# EAGLE schematic modulev2 (EAGLE 9.5.1)
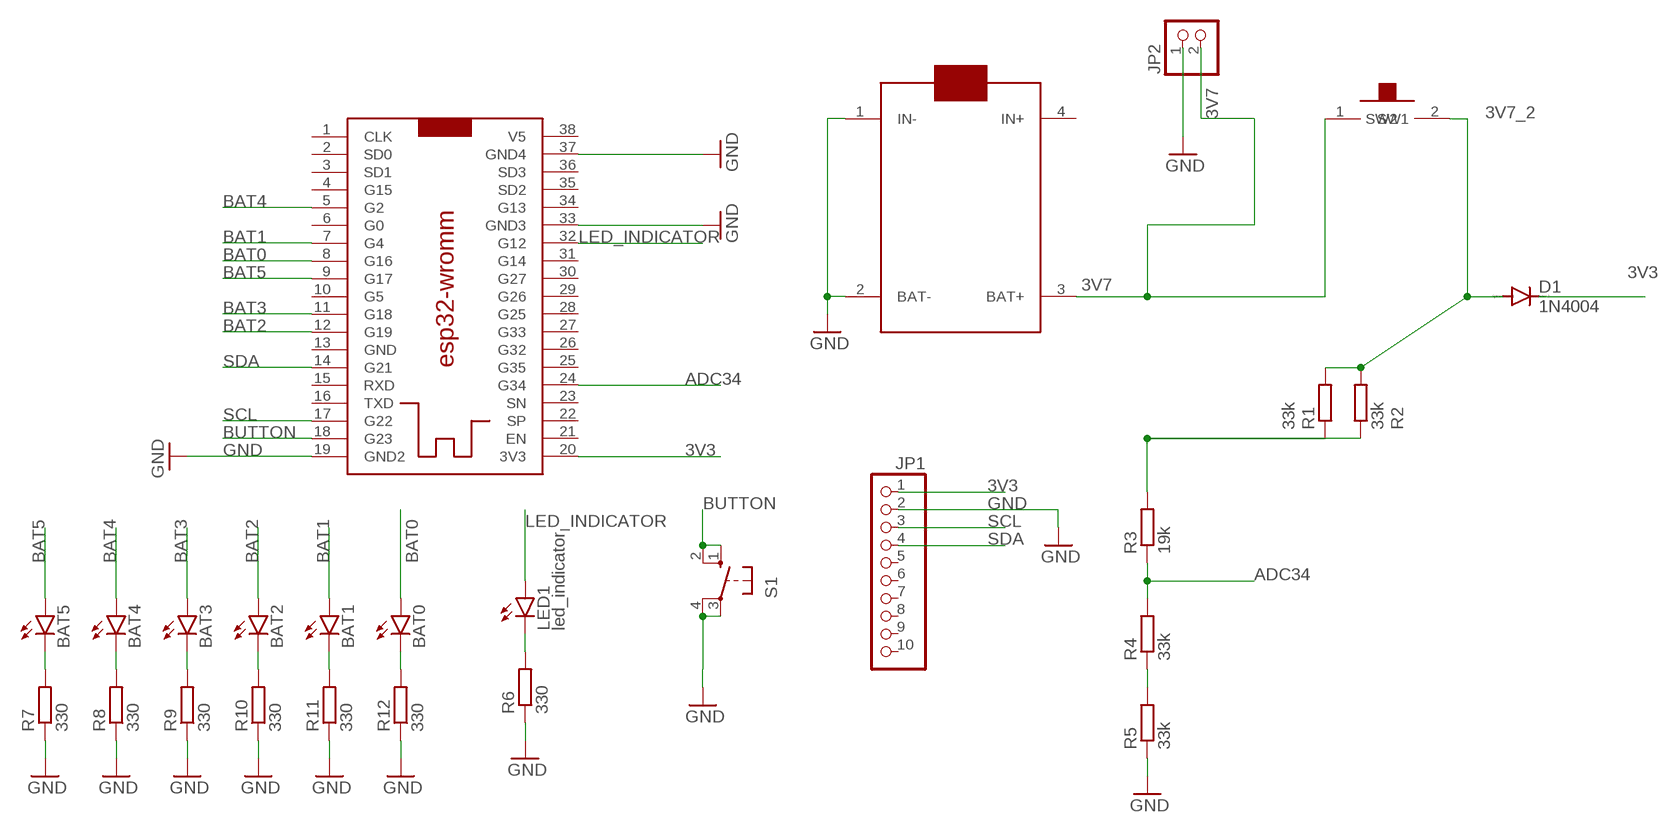
[diagram p0: schematic, sheet 1]

## Parts
BAT0  led_indicator  LED3MM  [LED3MM]
BAT1  led_indicator  LED3MM  [LED3MM]
BAT2  led_indicator  LED3MM  [LED3MM]
BAT3  led_indicator  LED3MM  [LED3MM]
BAT4  led_indicator  LED3MM  [LED3MM]
BAT5  led_indicator  LED3MM  [LED3MM]
D1  1N4004  [DO41-10]
JP1  PINHD-1X10  [1X10]
JP2  PINHD-1X2  [1X02]
LED1  led_indicator  LED3MM  [LED3MM]
R1  33k  R-EU_0204/7  [0204/7]
R2  33k  R-EU_0204/7  [0204/7]
R3  19k  R-EU_0204/7  [0204/7]
R4  33k  R-EU_0204/7  [0204/7]
R5  33k  R-EU_0204/7  [0204/7]
R6  330  R-EU_0204/7  [0204/7]
R7  330  R-EU_0204/7  [0204/7]
R8  330  R-EU_0204/7  [0204/7]
R9  330  R-EU_0204/7  [0204/7]
R10  330  R-EU_0204/7  [0204/7]
R11  330  R-EU_0204/7  [0204/7]
R12  330  R-EU_0204/7  [0204/7]
S1  10-XX  [B3F-10XX]
U$1  ESP32-WROMM2  [ESP32-WORMM2]
U$2  CHARGET_MODULE  [CHARGET_MODULE]
U$3  MINI_SWITCH  [MINI_SWITCH]

## Nets
3V3: D1.C JP1.1 U$1.20(3V3)
3V7: JP2.2 U$2.3(BAT+) U$3.1(SW1)
3V7_2: D1.A R1.2 R2.2 U$3.2(SW2)
ADC34: R3.1 R4.2 U$1.24(G34)
BAT0: BAT0.A U$1.8(G16)
BAT1: BAT1.A U$1.7(G4)
BAT2: BAT2.A U$1.12(G19)
BAT3: BAT3.A U$1.11(G18)
BAT4: BAT4.A U$1.5(G2)
BAT5: BAT5.A U$1.9(G17)
BUTTON: S1.1(S) S1.2(S1) U$1.18(G23)
GND: JP1.2 JP2.1 R5.1 R6.1 R7.1 R8.1 R9.1 R10.1 R11.1 R12.1 S1.3(P) S1.4(P1) U$1.19(GND2) U$1.33(GND3) U$1.37(GND4) U$2.1(IN-) U$2.2(BAT-)
LED_INDICATOR: LED1.A U$1.32(G12)
N$1: R4.1 R5.2
N$2: LED1.K(C) R6.2
N$3: BAT5.K(C) R7.2
N$4: R1.1 R2.1 R3.2
N$5: BAT4.K(C) R8.2
N$7: BAT3.K(C) R9.2
N$8: BAT2.K(C) R10.2
N$9: BAT1.K(C) R11.2
N$10: BAT0.K(C) R12.2
SCL: JP1.3 U$1.17(G22)
SDA: JP1.4 U$1.14(G21)
Unconnected: JP1.5 JP1.6 JP1.7 JP1.8 JP1.9 JP1.10 U$1.1(CLK) U$1.2(SD0) U$1.3(SD1) U$1.4(G15) U$1.6(G0) U$1.10(G5) U$1.13(GND) U$1.15(RXD) U$1.16(TXD) U$1.21(EN) U$1.22(SP) U$1.23(SN) U$1.25(G35) U$1.26(G32) U$1.27(G33) U$1.28(G25) U$1.29(G26) U$1.30(G27) U$1.31(G14) U$1.34(G13) U$1.35(SD2) U$1.36(SD3) U$1.38(V5) U$2.4(IN+)

## Library data of the parts
BAT0 BAT1-BAT5 LED1 = led:LED: LED OSRAM: - CHIPLED LG R971, LG N971, LY N971, LG Q971, LY Q971, LO R971, LY R971 LH N974, LH R974 LS Q976, LO Q976, LY Q976 LO Q996 - Hyper CHIPLED LW Q18S LB Q993, LB Q99A, LB R99A - SideLED LS A670, LO A670, LY A670, LG A670, LP A670 LB A673, LV A673, LT A673, LW A673 LH A674 LY A675 LS A676, LA A676, LO A676, LY A676, LW A676 LS A679, LY A679, LG A679 - Hyper Micro SIDELED® LS Y876, LA Y876, LO Y876, LY Y876 LT Y87S - SmartLED LW L88C, LW L88S LB L89C, LB L89S, LG L890 LS L89K, LO L89K, LY L89K LS L896, LA L896, LO L896, LY L896 - TOPLED LS T670, LO T670, LY T670, LG T670, LP T670 LSG T670, LSP T670, LSY T670, LOP T670, LYG T670 LG T671, LOG T671, LSG T671 LB T673, LV T673, LT T673, LW T673 LH T674 LS T676, LA T676, LO T676, LY T676, LB T676, LH T676, LSB T676, LW T676 LB T67C, LV T67C, LT T67C, LS T67K, LO T67K, LY T67K, LW E67C LS E67B, LA E67B, LO E67B, LY E67B, LB E67C, LV E67C, LT E67C LW T67C LS T679, LY T679, LG T679 LS T770, LO T770, LY T770, LG T770, LP T770 LB T773, LV T773, LT T773, LW T773 LH T774 LS E675, LA E675, LY E675, LS T675 LS T776, LA T776, LO T776, LY T776, LB T776 LHGB T686 LT T68C, LB T68C - Hyper Mini TOPLED® LB M676 - Mini TOPLED Santana® LG M470 LS M47K, LO M47K, LY M47K Source: http://www.osram.convergy.de LUXEON: - LUMILED® LXK2-PW12-R00, LXK2-PW12-S00, LXK2-PW14-U00, LXK2-PW14-V00 LXK2-PM12-R00, LXK2-PM12-S00, LXK2-PM14-U00 LXK2-PE12-Q00, LXK2-PE12-R00, LXK2-PE12-S00, LXK2-PE14-T00, LXK2-PE14-U00 LXK2-PB12-K00, LXK2-PB12-L00, LXK2-PB12-M00, LXK2-PB14-N00, LXK2-PB14-P00, LXK2-PB14-Q00 LXK2-PR12-L00, LXK2-PR12-M00, LXK2-PR14-Q00, LXK2-PR14-R00 LXK2-PD12-Q00, LXK2-PD12-R00, LXK2-PD12-S00 LXK2-PH12-R00, LXK2-PH12-S00 LXK2-PL12-P00, LXK2-PL12-Q00, LXK2-PL12-R00 Source: www.luxeon.com KINGBRIGHT: KA-3528ASYC Source: www.kingbright.com
D1 = diode:1N4004: DIODE general purpose rectifier, 1 A
JP1 = pinhead:PINHD-1X10: PIN HEADER
JP2 = pinhead:PINHD-1X2: PIN HEADER
R1-R12 = rcl:R-EU_: RESISTOR, European symbol; SPICEPREFIX: R
S1 = switch-omron:10-XX: OMRON SWITCH
U$1 = esp32-wromm2:ESP32-WROMM2
U$2 = charget_module:CHARGET_MODULE
U$3 = mini_switch:MINI_SWITCH

## Net classes
0 default: width 0.5 mm